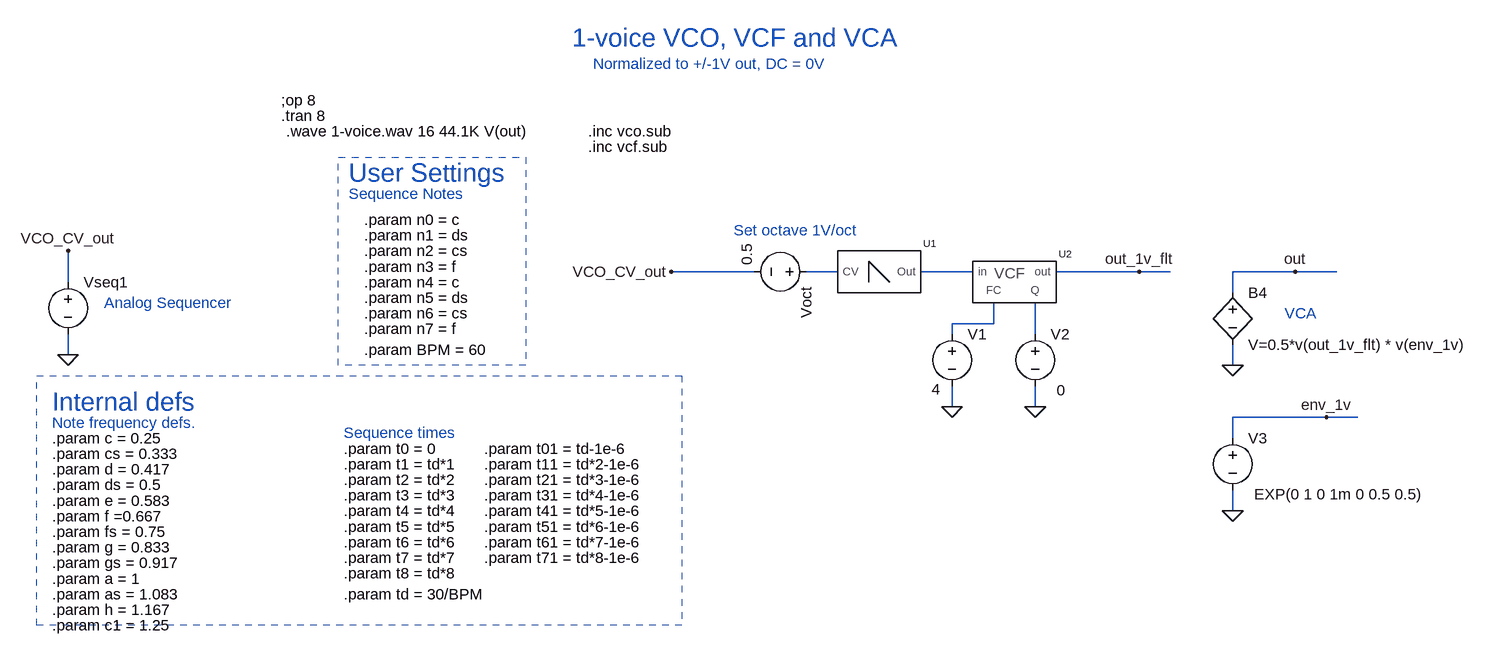
[diagram p0: schematic 1-voice.asc]
1-voice.asc, the LTspice schematic file:
Version 4
SHEET 1 2412 1252
WIRE -112 336 -240 336
WIRE 16 336 -32 336
WIRE 224 336 144 336
WIRE 480 336 352 336
WIRE 528 336 480 336
WIRE 720 336 624 336
WIRE 784 336 720 336
WIRE -1168 352 -1168 304
WIRE 624 368 624 336
WIRE 256 416 256 384
WIRE 256 416 192 416
WIRE 192 432 192 416
WIRE 320 432 320 384
WIRE -1168 464 -1168 432
WIRE 624 480 624 448
WIRE 192 544 192 512
WIRE 320 544 320 512
WIRE 768 560 624 560
WIRE 816 560 768 560
WIRE 624 592 624 560
WIRE 624 704 624 672
FLAG 624 480 0
FLAG 720 336 out
FLAG -1168 464 0
FLAG -1168 304 VCO_CV_out
FLAG -240 336 VCO_CV_out
FLAG 192 544 0
FLAG 320 544 0
FLAG 480 336 out_1v_flt
FLAG 624 704 0
FLAG 768 560 env_1v
SYMBOL bv 624 352 R0
SYMATTR InstName B4
SYMATTR Value V=0.5*v(out_1v_flt) * v(env_1v)
SYMBOL voltage -1168 336 R0
WINDOW 3 28 110 Invisible 2
SYMATTR Value PWL REPEAT FOREVER ({t0} {n0} {t01} {n0} {t1} {n1} {t11} {n1} {t2} {n2} {t21} {n2} {t3} {n3} {t31} {n3} {t4} {n4} {t41} {n4} {t5} {n5} {t51} {n5} {t6} {n6} {t61} {n6} {t7} {n7} {t71} {n7} {t8} {n0}) ENDREPEAT
SYMATTR InstName Vseq1
SYMBOL vco 80 288 R0
SYMATTR InstName U1
SYMBOL vcf 288 304 R0
SYMATTR InstName U2
SYMBOL voltage 320 416 R0
WINDOW 123 0 0 Left 0
WINDOW 39 0 0 Left 0
WINDOW 3 33 102 Left 2
SYMATTR Value 0
SYMATTR InstName V2
SYMBOL voltage 624 576 R0
WINDOW 123 0 0 Left 0
WINDOW 39 0 0 Left 0
WINDOW 3 33 102 Left 2
SYMATTR Value EXP(0 1 0 1m 0 0.5 0.5)
SYMATTR InstName V3
SYMBOL voltage -16 336 R90
WINDOW 123 0 0 Left 0
WINDOW 39 0 0 Left 0
WINDOW 3 -43 108 Left 2
SYMATTR Value 0.5
SYMATTR InstName Voct
SYMBOL voltage 192 416 R0
WINDOW 123 0 0 Left 0
WINDOW 39 0 0 Left 0
WINDOW 3 -31 101 Left 2
SYMATTR Value 4
SYMATTR InstName V1
TEXT -840 72 Left 2 !;op 8
TEXT -840 96 Left 2 !.tran 8
TEXT -392 -24 Left 4 ;1-voice VCO, VCF and VCA
TEXT -832 120 Left 2 !.wave 1-voice.wav 16 44.1K V(out)
TEXT -360 16 Left 2 ;Normalized to +/-1V out, DC = 0V
TEXT -1112 384 Left 2 ;Analog Sequencer
TEXT -1192 568 Left 2 ;Note frequency defs.
TEXT -736 216 Left 2 ;Sequence Notes
TEXT -744 584 Left 2 ;Sequence times
TEXT -744 608 Left 2 !.param t0 = 0
TEXT -528 608 Left 2 !.param t01 = td-1e-6
TEXT -744 832 Left 2 !.param td = 30/BPM
TEXT -744 632 Left 2 !.param t1 = td*1
TEXT -528 632 Left 2 !.param t11 = td*2-1e-6
TEXT -744 656 Left 2 !.param t2 = td*2
TEXT -528 656 Left 2 !.param t21 = td*3-1e-6
TEXT -528 680 Left 2 !.param t31 = td*4-1e-6
TEXT -744 680 Left 2 !.param t3 = td*3
TEXT -744 704 Left 2 !.param t4 = td*4
TEXT -528 704 Left 2 !.param t41 = td*5-1e-6
TEXT -744 728 Left 2 !.param t5 = td*5
TEXT -528 728 Left 2 !.param t51 = td*6-1e-6
TEXT -528 752 Left 2 !.param t61 = td*7-1e-6
TEXT -744 752 Left 2 !.param t6 = td*6
TEXT -528 776 Left 2 !.param t71 = td*8-1e-6
TEXT -744 776 Left 2 !.param t7 = td*7
TEXT -1192 536 Left 4 ;Internal defs
TEXT -736 184 Left 4 ;User Settings
TEXT -744 800 Left 2 !.param t8 = td*8
TEXT 704 400 Left 2 ;VCA
TEXT -368 120 Left 2 !.inc vco.sub
TEXT -368 144 Left 2 !.inc vcf.sub
TEXT -712 280 Left 2 !.param n1 = ds
TEXT -712 304 Left 2 !.param n2 = cs
TEXT -712 328 Left 2 !.param n3 = f
TEXT -712 352 Left 2 !.param n4 = c
TEXT -712 376 Left 2 !.param n5 = ds
TEXT -712 400 Left 2 !.param n6 = cs
TEXT -712 424 Left 2 !.param n7 = f
TEXT -712 456 Left 2 !.param BPM = 60
TEXT -712 256 Left 2 !.param n0 = c
TEXT -144 272 Left 2 ;Set octave 1V/oct
TEXT -1192 640 Left 2 !.param d = 0.417
TEXT -1192 664 Left 2 !.param ds = 0.5
TEXT -1192 688 Left 2 !.param e = 0.583
TEXT -1192 712 Left 2 !.param f =0.667
TEXT -1192 736 Left 2 !.param fs = 0.75
TEXT -1192 760 Left 2 !.param g = 0.833
TEXT -1192 784 Left 2 !.param gs = 0.917
TEXT -1192 808 Left 2 !.param a = 1
TEXT -1192 832 Left 2 !.param as = 1.083
TEXT -1192 856 Left 2 !.param h = 1.167
TEXT -1192 616 Left 2 !.param cs = 0.333
TEXT -1192 592 Left 2 !.param c = 0.25
TEXT -1192 880 Left 2 !.param c1 = 1.25
RECTANGLE Normal -224 880 -1216 496 2
RECTANGLE Normal -464 480 -752 160 2

The netlist it stands for:
* 1-voice.asc
B4 out 0 V=0.5*v(out_1v_flt) * v(env_1v)
Vseq1 VCO_CV_out 0 PWL REPEAT FOREVER ({t0} {n0} {t01} {n0} {t1} {n1} {t11} {n1} {t2} {n2} {t21} {n2} {t3} {n3} {t31} {n3} {t4} {n4} {t41} {n4} {t5} {n5} {t51} {n5} {t6} {n6} {t61} {n6} {t7} {n7} {t71} {n7} {t8} {n0}) ENDREPEAT
XU1 N001 N002 vco  ; pins CV Out
XU2 N002 out_1v_flt N003 N004 vcf  ; pins in out FC Q
V2 N004 0 0
V3 env_1v 0 EXP(0 1 0 1m 0 0.5 0.5)
Voct N001 VCO_CV_out 0.5
V1 N003 0 4
;op 8
.tran 8
* 1-voice VCO, VCF and VCA
.wave 1-voice.wav 16 44.1K V(out)
* Normalized to +/-1V out, DC = 0V
* Analog Sequencer
* Note frequency defs.
* Sequence Notes
* Sequence times
.param t0 = 0
.param t01 = td-1e-6
.param td = 30/BPM
.param t1 = td*1
.param t11 = td*2-1e-6
.param t2 = td*2
.param t21 = td*3-1e-6
.param t31 = td*4-1e-6
.param t3 = td*3
.param t4 = td*4
.param t41 = td*5-1e-6
.param t5 = td*5
.param t51 = td*6-1e-6
.param t61 = td*7-1e-6
.param t6 = td*6
.param t71 = td*8-1e-6
.param t7 = td*7
* Internal defs
* User Settings
.param t8 = td*8
* VCA
.inc vco.sub
.inc vcf.sub
.param n1 = ds
.param n2 = cs
.param n3 = f
.param n4 = c
.param n5 = ds
.param n6 = cs
.param n7 = f
.param BPM = 60
.param n0 = c
* Set octave 1V/oct
.param d = 0.417
.param ds = 0.5
.param e = 0.583
.param f =0.667
.param fs = 0.75
.param g = 0.833
.param gs = 0.917
.param a = 1
.param as = 1.083
.param h = 1.167
.param cs = 0.333
.param c = 0.25
.param c1 = 1.25
.backanno
.end